# EasyEDA Pro project 毕设.eprj, board PCB5
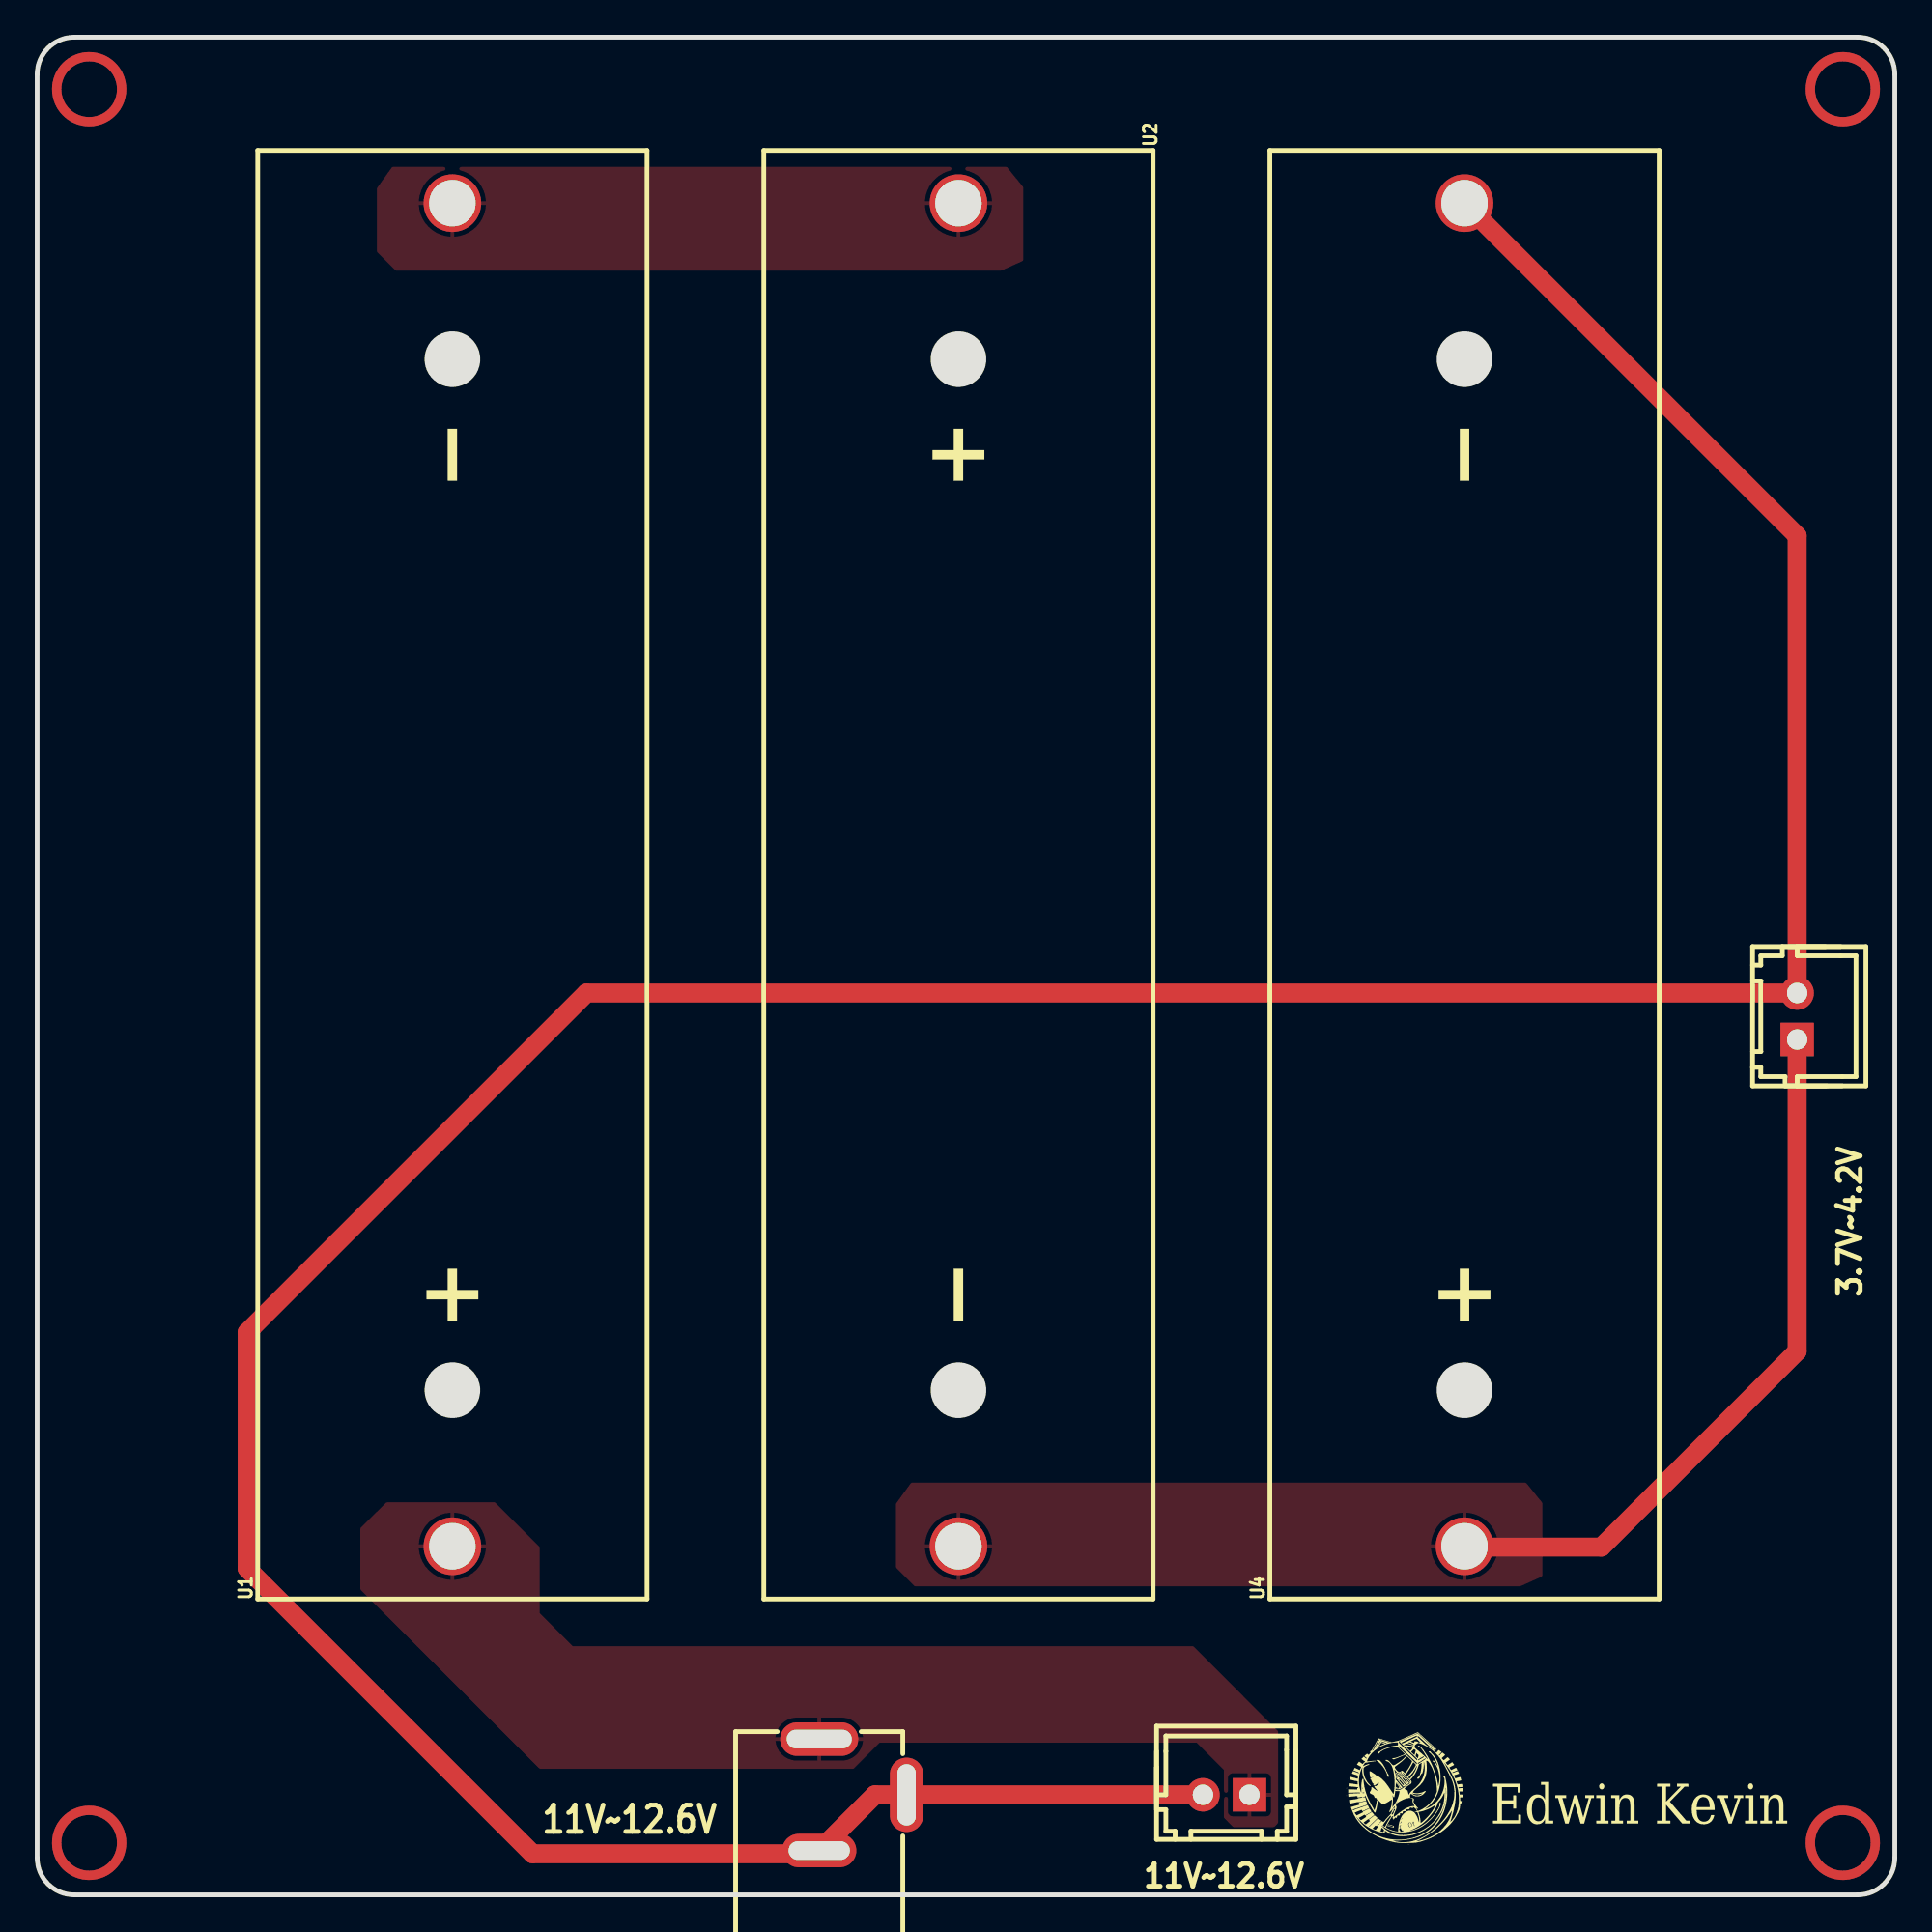
[diagram p7: board, top side]
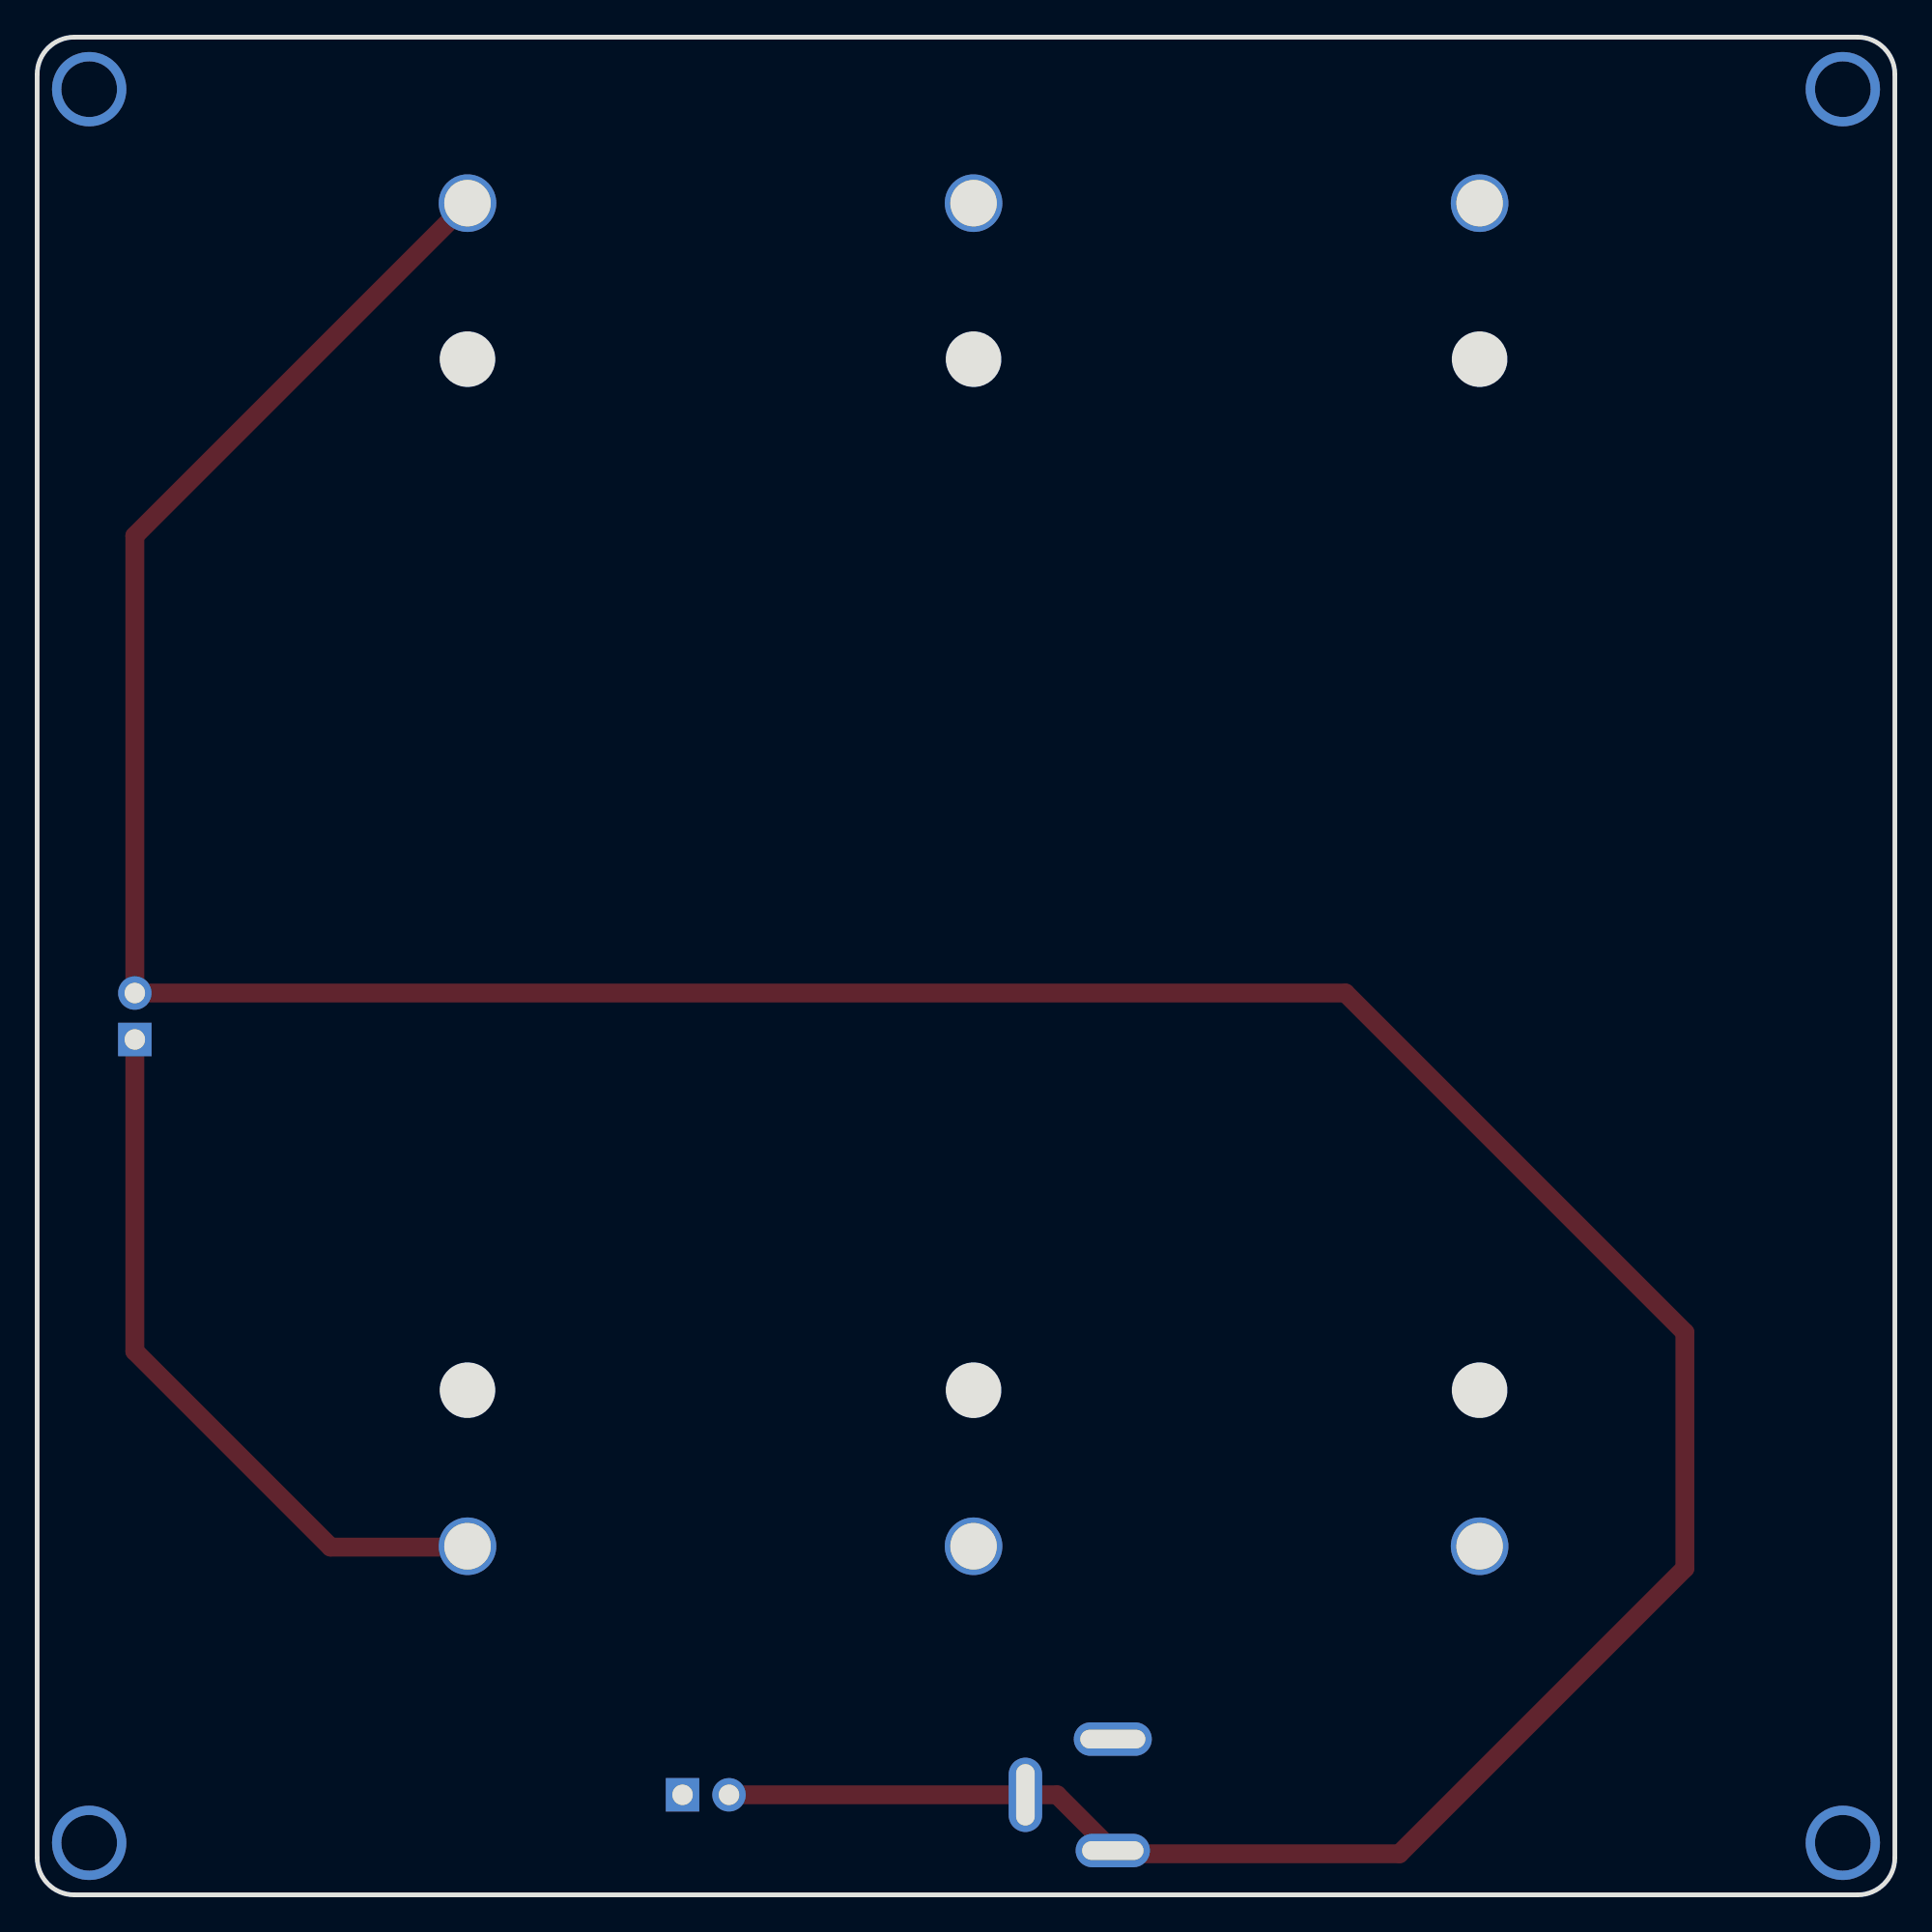
[diagram p8: board, bottom side, seen from below]

Outline 100 x 100 mm; copper layers: Top Layer, Bottom Layer. Coordinates in mm from the lower left corner of the outline.
Outline path: 0,98 0,2 arc(0.59,0.59) 2,0 98,0 arc(99.41,0.59) 100,2 100,98 arc(99.41,99.41) 98,100 2,100 arc(0.59,99.41) 0,98
Stack: Top Layer 0.035mm / Dielectric1 1.51mm FR4 er 4.5 / Bottom Layer 0.035mm

## Design rules (mm)
template: JLCPCB Capability(Two Layers Board)
spacing copperThickness1oz (default): track to track 0.102, other pairs 0.152 to 0.3
spacing copperThickness2oz: track to track 0.203, other pairs 0.152 to 0.3
track width copperThickness1oz (default): min 0.127, default 0.254, max 2.54
track width copperThickness2oz: min 0.203, default 0.254, max 2.54
differential pair differentialPair (default): width min 0.127, default 0.254, max 2.54; gap min 0.152, default 0.152
via viaSize (default): diameter min 0.5, default 0.61, max 10; hole min 0.3, default 0.305, max 6.3

## Placement (name value [footprint] x y rotation side)
3.7V~4.2V  ZX-XH2.54-2PZZ  [CONN-TH_2P-P2.50_HX25003-2A]  94.74 47.3 90 top
11V~12.6V  ZX-XH2.54-2PZZ  [CONN-TH_2P-P2.50_HX25003-2A]  64.01 5.38 180 top
DC1  DC-005-5A-2.0  [DC-IN-TH_DC-005-5A-2.0]  44.45 5.38 90 top
U1  BH-18650-A5BJ001-2D  [BAT-TH_BH-18650-A5BJ001-2D]  22.35 54.92 90 top
U2  BH-18650-A5BJ001-2D  [BAT-TH_BH-18650-A5BJ001-2D]  49.59 54.91 270 top
U4  BH-18650-A5BJ001-2D  [BAT-TH_BH-18650-A5BJ001-2D]  76.84 54.92 90 top

## Footprints (pads in the part's own frame, mm; a bottom-side part is the same pattern mirrored in y, then rotated)
BAT-TH_BH-18650-A5BJ001-2D
  round 3.1 hole 2.5: 1(-36.15,0) 2(36.15,0)
CONN-TH_2P-P2.50_HX25003-2A
  rect 1.8x1.8 hole 1.1: 1(-1.25,0)
  round 1.8 hole 1.1: 2(1.25,0)
DC-IN-TH_DC-005-5A-2.0
  oval 1.8x4.2 hole 1x3.5: 1(3,2.352)
  oval 1.8x4 hole 1x3.3: 2(-3,2.352)
  oval 4x1.8 hole 3.3x1: 3(-0.001,-2.352)

## Nets
$1N288: 3.7V~4.2V.1 U2.2 U4.1
$1N289: 11V~12.6V.1 DC1.1 U1.1
$1N296: U1.2 U2.1
$1N297: 3.7V~4.2V.2 11V~12.6V.2 DC1.2 DC1.3 U4.2

## Via types
v1: diameter 4, hole 2.999, Top Layer to Bottom Layer, 4 vias

## Routing (per net, layer and track width the routed paths; a pad name or vN(x,y) marks a point on that pad's centre or on a via; arc(x,y) is an arc through that point)
(no net):
  vias: v1(2.8,97.2) v1(2.8,2.8) v1(97.2,97.2) v1(97.2,2.8)
$1N288: length 39.1
  Top Layer w1.016: 76.84,18.76 76.88,18.72 84.2,18.72 94.74,29.26 3.7V~4.2V.1
$1N297: length 212.8
  Top Layer w1.016: 11V~12.6V.2 DC1.3 45.1,5.38 DC1.2 41.92,2.21 26.67,2.21 11.3,17.58 11.3,30.28 29.57,48.55 3.7V~4.2V.2 94.74,73.16 U4.2

## Copper pours and planes (outline as drawn; the poured copper is in the pictures)
$1N288 on Top Layer: 80.14,22.19 81.03,21.1 81.03,17.15 79.83,16.61 47.24,16.61 46.23,17.62 46.23,21.05 47.05,22.19
$1N289 on Top Layer: 66.59,3.65 66.8,3.86 66.8,8.81 62.23,13.39 28.83,13.39 27.05,15.16 27.05,18.72 24.64,21.13 18.8,21.13 17.4,19.74 17.4,16.43 27.05,6.78 43.94,6.78 45.35,8.19 62.42,8.19 63.88,6.73 63.88,4.15 64.39,3.65
$1N296 on Top Layer: 52.2,93.02 53.09,91.92 53.09,87.97 51.89,87.43 19.3,87.43 18.29,88.44 18.29,91.87 19.11,93.02

## Text on the board
Top Silkscreen Layer: 11V~12.6V | Edwin Kevin
